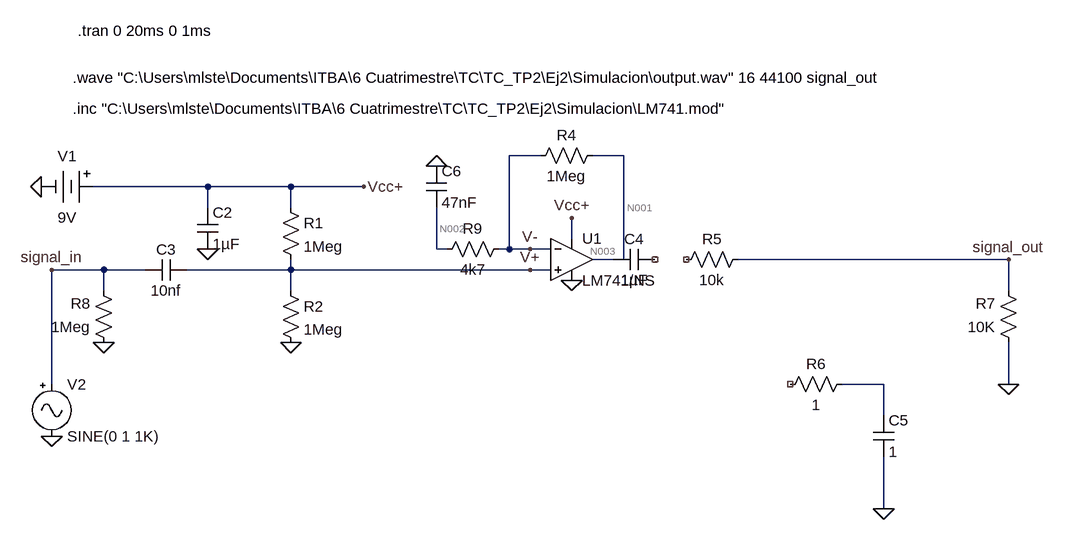
[diagram p0: schematic pedal no anda la entrada del opamp.asc]
pedal no anda la entrada del opamp.asc, the LTspice schematic file:
Version 4
SHEET 1 1880 792
WIRE 400 -16 352 -16
WIRE 528 -16 480 -16
WIRE -112 32 -288 32
WIRE 16 32 -112 32
WIRE 128 32 16 32
WIRE -112 64 -112 32
WIRE 16 64 16 32
WIRE 448 112 448 80
WIRE 240 128 240 64
WIRE 256 128 240 128
WIRE 352 128 352 -16
WIRE 352 128 336 128
WIRE 384 128 352 128
WIRE 416 128 384 128
WIRE 512 144 480 144
WIRE 528 144 528 -16
WIRE 1120 144 704 144
WIRE -272 160 -352 160
WIRE -208 160 -272 160
WIRE 16 160 16 144
WIRE 16 160 -144 160
WIRE 384 160 16 160
WIRE 416 160 384 160
WIRE -272 192 -272 160
WIRE 16 192 16 160
WIRE 1120 192 1120 144
WIRE -352 336 -352 160
WIRE 928 336 864 336
WIRE 1120 336 1120 272
WIRE 928 384 928 336
WIRE 928 528 928 448
FLAG 16 272 0
FLAG -272 272 0
FLAG 928 528 0
FLAG 1120 336 0
FLAG -112 128 0
FLAG 128 32 Vcc+
FLAG 448 80 Vcc+
FLAG -368 32 0
FLAG -352 416 0
FLAG 448 176 0
FLAG 1120 144 signal_out
FLAG -352 160 signal_in
FLAG 384 128 V-
FLAG 240 0 0
FLAG 384 160 V+
SYMBOL res 0 48 R0
SYMATTR InstName R1
SYMATTR Value 1Meg
SYMBOL res 0 176 R0
SYMATTR InstName R2
SYMATTR Value 1Meg
SYMBOL res 496 -32 R90
WINDOW 0 0 56 VBottom 2
WINDOW 3 32 56 VTop 2
SYMATTR InstName R4
SYMATTR Value 1Meg
SYMBOL cap -128 64 R0
SYMATTR InstName C2
SYMATTR Value 1µF
SYMBOL cap -144 144 R90
WINDOW 0 0 32 VBottom 2
WINDOW 3 32 32 VTop 2
SYMATTR InstName C3
SYMATTR Value 10nf
SYMBOL res 720 128 R90
WINDOW 0 0 56 VBottom 2
WINDOW 3 32 56 VTop 2
SYMATTR InstName R5
SYMATTR Value 10k
SYMBOL res 880 320 R90
WINDOW 0 0 56 VBottom 2
WINDOW 3 32 56 VTop 2
SYMATTR InstName R6
SYMATTR Value 1
SYMBOL res 1136 288 R180
WINDOW 0 36 76 Left 2
WINDOW 3 36 40 Left 2
SYMATTR InstName R7
SYMATTR Value 10K
SYMBOL res -256 288 R180
WINDOW 0 36 76 Left 2
WINDOW 3 36 40 Left 2
SYMATTR InstName R8
SYMATTR Value 1Meg
SYMBOL cap 576 128 R90
WINDOW 0 0 32 VBottom 2
WINDOW 3 32 32 VTop 2
SYMATTR InstName C4
SYMATTR Value 1µF
SYMBOL cap 912 384 R0
SYMATTR InstName C5
SYMATTR Value 1
SYMBOL Opamps\\opamp2 448 80 R0
SYMATTR InstName U1
SYMATTR Value LM741/NS
SYMBOL res 352 112 R90
WINDOW 0 0 56 VBottom 2
WINDOW 3 32 56 VTop 2
SYMATTR InstName R9
SYMATTR Value 4k7
SYMBOL cap 224 0 R0
SYMATTR InstName C6
SYMATTR Value 47nF
SYMBOL Misc\\battery -272 32 R90
WINDOW 0 -32 56 VBottom 2
WINDOW 3 32 56 VTop 2
SYMATTR InstName V1
SYMATTR Value 9V
SYMBOL Misc\\signal -352 320 R0
SYMATTR InstName V2
TEXT -320 -136 Left 2 !.wave "C:\\Users\\mlste\\Documents\\ITBA\\6 Cuatrimestre\\TC\\TC_TP2\\Ej2\\Simulacion\\output.wav" 16 44100 signal_out
TEXT -320 -88 Left 2 !.inc "C:\\Users\\mlste\\Documents\\ITBA\\6 Cuatrimestre\\TC\\TC_TP2\\Ej2\\Simulacion\\LM741.mod"
TEXT -312 -208 Left 2 !.tran 0 20ms 0 1ms

The netlist it stands for:
* pedal no anda la entrada del opamp.asc
R1 Vcc+ V+ 1Meg
R2 V+ 0 1Meg
R4 N001 V- 1Meg
C2 Vcc+ 0 1µF
C3 V+ signal_in 10nf
R5 signal_out NC_01 10k
R6 N004 NC_02 1
R7 0 signal_out 10K
R8 0 signal_in 1Meg
C4 NC_03 N003 1µF
C5 N004 0 1
XU1 V+ V- Vcc+ 0 N003 LM741/NS  ; pins In+ In- V+ V- OUT
R9 V- N002 4k7
C6 0 N002 47nF
V1 Vcc+ 0 9V
V2 signal_in 0 SINE(0 1 1K)
.wave "C:\Users\mlste\Documents\ITBA\6 Cuatrimestre\TC\TC_TP2\Ej2\Simulacion\output.wav" 16 44100 signal_out
.inc "C:\Users\mlste\Documents\ITBA\6 Cuatrimestre\TC\TC_TP2\Ej2\Simulacion\LM741.mod"
.tran 0 20ms 0 1ms
.backanno
.end

* Results of the author's LTspice run, read from the files saved beside the schematic
* Operating Point, zero values left out:
*   V(vcc+) = 9 V
*   V(v+) = 4.42 V
*   V(n001) = 4.391 V
*   V(v-) = 4.391 V
*   V(n003) = 8.01 V
*   V(n002) = 4.391 V
*   I(R2) = 4.42 µA
*   I(R1) = 4.58 µA
*   I(V1) = -1.443 mA
*   Ix(u1:1) = 159.7 nA
*   Ix(u1:99) = 1.439 mA
*   Ix(u1:50) = -1.439 mA
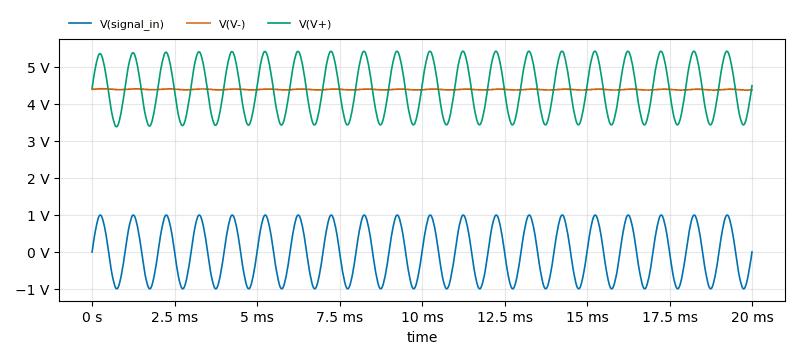
[diagram p1: Transient Analysis of pedal no anda la entrada del opamp.asc, plotted from the saved traces]
* Transient Analysis, 1 run:
*   V(signal_in): min -997.6 mV, max 996.4 mV, average 303.1 µV, rms 698.1 mV, last 0 V
*   V(V-): min 4.372 V, max 4.408 V, average 4.387 V, rms 4.387 V, last 4.378 V
*   V(V+): min 3.382 V, max 5.421 V, average 4.42 V, rms 4.474 V, last 4.491 V